# Altium schematic sheet Teensy PCB Schematic.SchDoc
size A; SheetNumber: 1; SheetTotal: 1
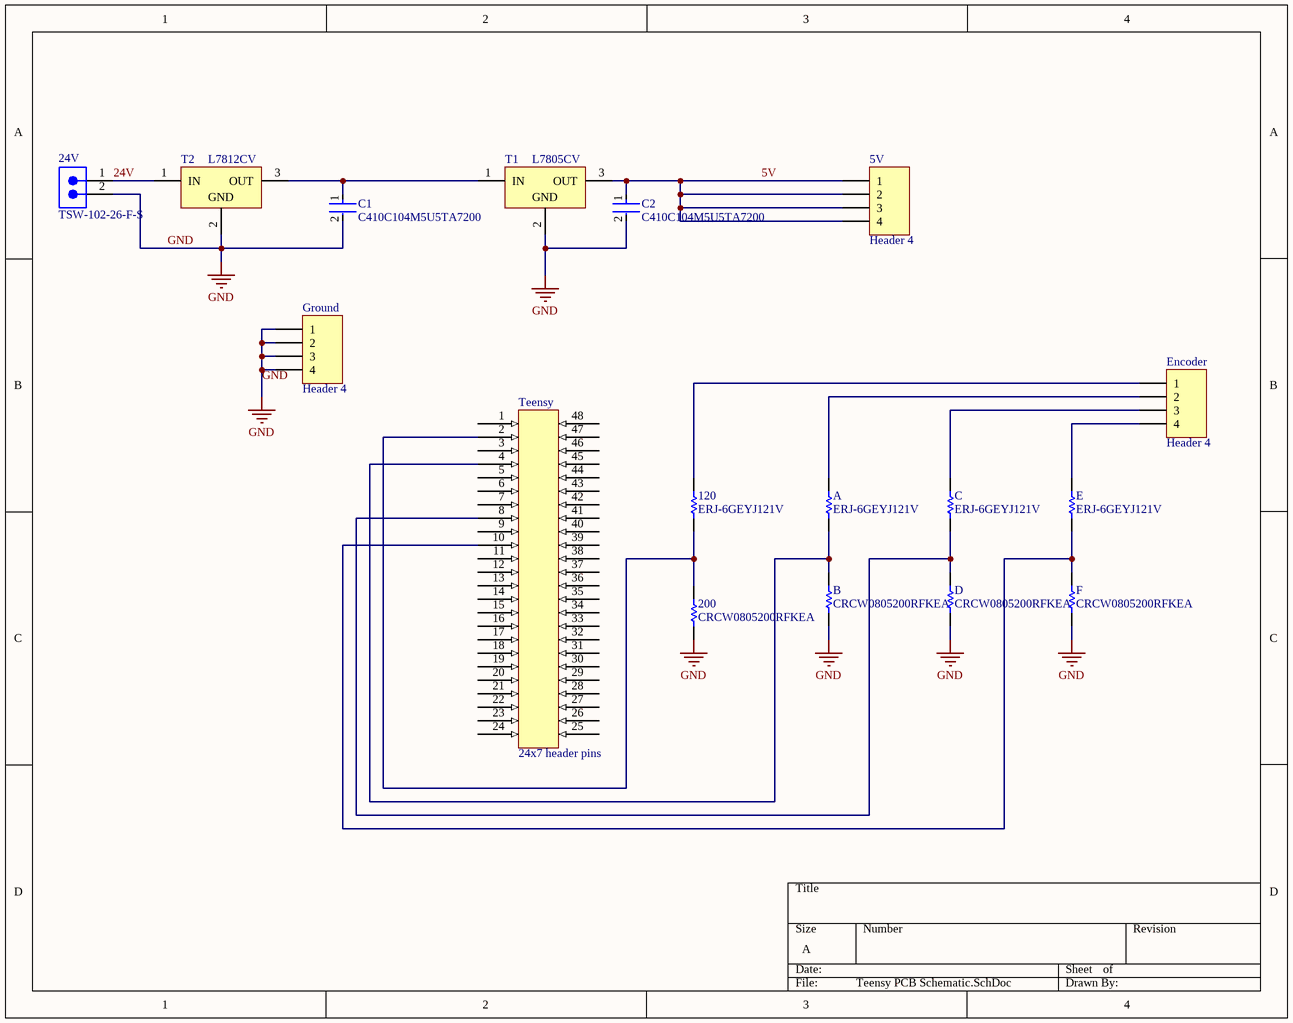
[diagram p0: Teensy PCB Schematic.SchDoc]

## Parts
5V  Header 4  [HDR1X4]
24V  TSW-102-26-F-S  [SMTC-TSW-102-26-XX-S]
120  ERJ-6GEYJ121V  [RESC2013X70X40LL20T20]
200  CRCW0805200RFKEA  [RESC2013X50X30NL20T20]
A  ERJ-6GEYJ121V  [RESC2013X70X40LL20T20]
B  CRCW0805200RFKEA  [RESC2013X50X30NL20T20]
C  ERJ-6GEYJ121V  [RESC2013X70X40LL20T20]
C1  C410C104M5U5TA7200  [FP-C410C104M5U5TA7200-MFG]
C2  C410C104M5U5TA7200  [FP-C410C104M5U5TA7200-MFG]
D  CRCW0805200RFKEA  [RESC2013X50X30NL20T20]
E  ERJ-6GEYJ121V  [RESC2013X70X40LL20T20]
Encoder  Header 4  [HDR1X4]
F  CRCW0805200RFKEA  [RESC2013X50X30NL20T20]
Ground  Header 4  [HDR1X4]
T1  L7805CV  [TO220]
T2  L7812CV  [TO220]
Teensy  24x7 header pins  [New footprint 1]

## Nets
GND: 24V.2 200.1 B.1 C1.2 C2.2 D.1 F.1 Ground.1 Ground.2 Ground.3 Ground.4 T1.2(GND) T2.2(GND)
5V: 5V.1 5V.2 5V.3 5V.4 C2.1 T1.3(OUT)
24V: 24V.1 T2.1(IN)
Net120_1: 120.1 200.2 Teensy.2
Net120_2: 120.2 Encoder.1
NetA_1: A.1 B.2 Teensy.4
NetA_2: A.2 Encoder.2
NetC1_1: C1.1 T1.1(IN) T2.3(OUT)
NetC_1: C.1 D.2 Teensy.8
NetC_2: C.2 Encoder.3
NetE_1: E.1 F.2 Teensy.10
NetE_2: E.2 Encoder.4

Not connected (* = marked no-connect by the designer): Teensy 1 3 5 6 7 9 11 12 13 14 15 16 17 18 19 20 21 22 23 24 25 26 27 28 29 30 31 32 33 34 35 36 37 38 39 40 41 42 43 44 45 46 47 48

## Library data of the parts
5V Encoder Ground = CMP-002-000097-1: Header, 4-Pin; Signal Integrity: Connector; Pin Count: 4; Design Item ID: Header 4; Publisher: Altium Limited; LatestRevisionDate: 17-Jul-2002; LatestRevisionNote: Re-released for DXP Platform.; Component Type: Standard; Source: Miscellaneous Connectors.SchLib
24V = CMP-1024-00329-1: 0.025" SQ Post Header, Through-hole, Vertical, -55 to 125 degC, 2.54 mm Pitch, 2-Pin, Male, RoHS; Manufacturer: Samtec; Pitch: 2.54 mm; PackageVersion: DM, 8/1988; ComponentLink2Description: Datasheet; PackageReference: TSW-102-26-XX-S; ComponentLink3URL: http://www.samtec.com/documents/webfiles/cpdf/TSW-XXX-XX-XXX-X-XX-XXX-MKT.pdf; ComponentLink2URL: http://www.samtec.com/documents/webfiles/pdf/TSW_TH.PDF; ComponentLink1Description: Manufacturer URL; DatasheetVersion: F-214; RoHS: True; ComponentLink3Description: Package Specification; PartNumber: TSW-102-26-F-S; Temperature Range: -55 to 125 degC; Orientation: Vertical; ComponentLink1URL: http://www.samtec.com; PackageDescription: .025[0.64] SQ. Post Terminal Strip Assembly; Mounting Technology: Through-hole
120 A C E = CMP-2001-00345-1: Manufacturer: Panasonic; Part Number: ERJ-6GEYJ121V
200 B D F = CMP-2001-03663-1: Manufacturer: Vishay Dale; Part Number: CRCW0805200RFKEA
C1 C2 = CMP-03020-034640-1: CAP CER 0.1UF 50V Z5U AXIAL; Capacitance: 100nF; Tolerance: 20%; Lead Diameter: 0.51mm; Dissipation Factor: 4%; Lead Length: 25.4mm; Mount: Through Hole; Length: 4.32mm; Lead Free: Lead Free; Number of Pins: 2; Case/Package: Axial; Max Operating Temperature: 85°C; RoHS Compliant: Yes; Dielectric: Z5U; Min Operating Temperature: 10°C; Series: Aximax 400; Termination: Axial; Radiation Hardening: No; Voltage Rating (DC): 50V; REACH SVHC: No SVHC; Construction: AXIAL; Package Quantity: 5000; Packaging: Tape and Reel; Voltage Rating: 50V
T1 = CMP-0244-00483-1: Positive Voltage Regulator, 5V, 3-Pin TO-220; PackageDescription: TO, Thru-Hole, Vertical, Heatsink Mounted; 3 In-Line Leads; Pitch 2.54 mm; ComponentLink2Description: Datasheet; PackageReference: TO220; ComponentLink3URL: http://www.st.com/internet/com/TECHNICAL_RESOURCES/TECHNICAL_LITERATURE/PACKAGE_INFORMATION/CD00004649.pdf; DatasheetVersion: 16/11/2011; ComponentLink1Description: Manufacturer URL; ComponentLink1URL: http://www.st.com; PackageVersion: ver3.0; ComponentLink3Description: Package Specification; ComponentLink2URL: http://www.st.com/internet/com/TECHNICAL_RESOURCES/TECHNICAL_LITERATURE/DATASHEET/CD00000444.pdf
T2 = CMP-0244-00450-1: Positive Voltage Regulator, 12V, 3-Pin TO-220; PackageDescription: TO, Thru-Hole, Vertical, Heatsink Mounted; 3 In-Line Leads; Pitch 2.54 mm; ComponentLink3URL: http://www.st.com/internet/com/TECHNICAL_RESOURCES/TECHNICAL_LITERATURE/PACKAGE_INFORMATION/CD00004649.pdf; ComponentLink1URL: http://www.st.com; ComponentLink2Description: Datasheet; ComponentLink3Description: Package Specification; ComponentLink2URL: http://www.st.com/internet/com/TECHNICAL_RESOURCES/TECHNICAL_LITERATURE/DATASHEET/CD00000444.pdf; DatasheetVersion: 16/11/2011; PackageVersion: ver3.0; PackageReference: TO220; ComponentLink1Description: Manufacturer URL
Teensy = CMP-00012-1: for teensy 3.6